# EAGLE design variablePedal (EAGLE 9.6.0)
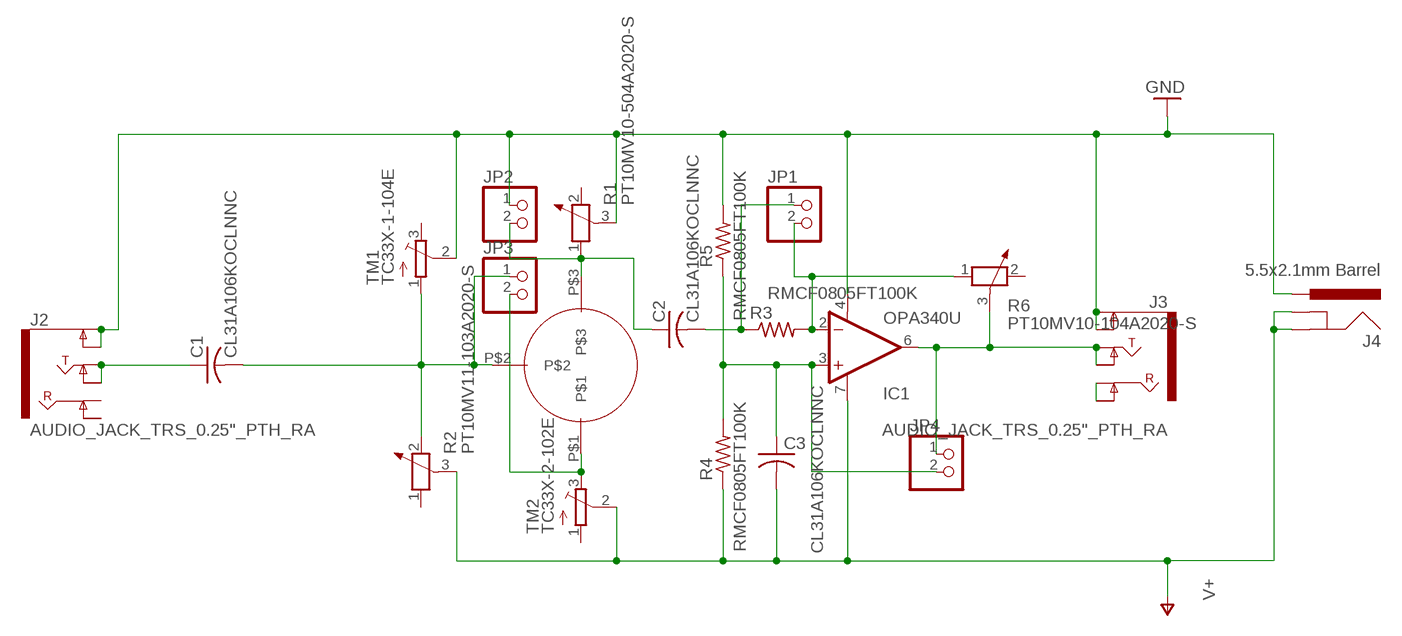
[diagram p0: schematic, sheet 1]

## Parts
C1  CL31A106KOCLNNC  C-USC1206  [C1206]
C2  CL31A106KOCLNNC  C-USC1206  [C1206]
C3  CL31A106KOCLNNC  C-USC1206  [C1206]
IC1  OPA340U  [SO08]
J2  AUDIO_JACK_TRS_0.25"_PTH_RA  [AUDIO_JACK_0.25"_TRS_PTH_RA]
J3  AUDIO_JACK_TRS_0.25"_PTH_RA  [AUDIO_JACK_0.25"_TRS_PTH_RA]
J4  5.5x2.1mm Barrel  POWER_JACKSMD  [POWER_JACK_SMD]
JP1  PINHD-1X2  [1X02]
JP2  PINHD-1X2  [1X02]
JP3  PINHD-1X2  [1X02]
JP4  PINHD-1X2  [1X02]
R1  PT10MV10-504A2020-S  POTENTIOMETER_PT-10  [PT-10]
R2  PT10MV11-103A2020-S  POTENTIOMETER_PT-10  [PT-10]
R3  RMCF0805FT100K  R-US_R0805  [R0805]
R4  RMCF0805FT100K  R-US_R0805  [R0805]
R5  RMCF0805FT100K  R-US_R0805  [R0805]
R6  PT10MV10-104A2020-S  POTENTIOMETER_PT-10  [PT-10]
TM1  TC33X-1-104E  TRIMPOTTC33X  [TC33X]
TM2  TC33X-2-102E  TRIMPOTTC33X  [TC33X]
U$1  917-43-103-41-005000  [TO-5]

## Nets
GND: IC1.4(V-) J2.SLEEVE(EARTH) J2.SLEEVE-NORM(EARTH-NORM) J3.SLEEVE(EARTH) J3.SLEEVE-NORM(EARTH-NORM) J4.VIN0(PWR) JP2.1 R1.3 R5.2 TM1.2(S)
N$1: C1.2 JP3.1 R2.2 TM1.1(A) U$1.P$2
N$2: C2.1 JP2.2 R1.1 U$1.P$3
N$3: JP3.2 TM2.3(E) U$1.P$1
N$4: C2.2 JP1.1 R3.1
N$5: C3.1 IC1.3(+IN) JP4.2 R4.2 R5.1
N$6: IC1.2(-IN) JP1.2 R3.2 R6.1
N$7: IC1.6(OUT) J3.TIP J3.TIP-NORM JP4.1 R6.3
N$8: J3.RING J3.RING-NORM
N$11: C1.1 J2.TIP J2.TIP-NORM
V+: C3.2 IC1.7(V+) J4.GND(GNDBREAK) J4.P$4(GND) R2.3 R4.1 TM2.2(S)
Unconnected: J2.RING J2.RING-NORM R1.2 R2.1 R6.2 TM1.3(E) TM2.1(A)

## Library data of the parts
C1-C3 = rcl:C-US: CAPACITOR, American symbol; SPICEPREFIX: C
IC1 = burr-brown:OPA340: Rail-to-Rail Operational Amplifiers Single-Supply, MicroAmplifier(TM) Series; MPN: OPA340UA; OC_FARNELL: 1106196; OC_NEWARK: 24M5449
J2 J3 = SparkFun-Connectors:AUDIO_JACK_TRS_0.25"_PTH_RA: Audio Jack, 1/4" TRS jack, horizontal, PTH, aka "Phono jack" Find the connector here: Audio Jack - 1/4" Stereo (right angle) <https://www.sparkfun.com/products/11144> (COM-11144) Datasheet <http://cdn.sparkfun.com/datasheets/Components/General/JP-611%20DD.jpg> Note, although the datasheet and physical part are slightly different, this footprint was proven to mate well on the Proto Pedal. This device is used on these SparkFun Products: SparkFun TRS Jack Breakout - 1/4" Stereo <https://www.sparkfun.com/products/13005> (BOB-13005 ) SparkFun Proto Pedal - sorry bad link - product comming soon! <https://www.sparkfun.com/products/13124> (PRT-13124); PROD_ID: CONN-12339; SF_ID: COM-11144
J4 = SparkFun-Connectors:POWER_JACK: Power Jack Connector This is the standard 5.5mm barrel jack for power. The PTH is the most common, proven, reliable, footprint. The Slot footprint only works if the mill layer is transmitted to the PCB fab house so be warned. Here are the connectors we sell at SparkFun: DC Barrel Power Jack/Connector <https://www.sparkfun.com/products/119> (PRT-00119) DC Barrel Power Jack/Connector (SMD) <https://www.sparkfun.com/products/12748> (PRT-12748) DC Barrel Jack Adapter - Breadboard Compatible <https://www.sparkfun.com/products/10811> (PRT-10811) It is used on this SparkFun product (and many, many others): SparkFun RedBoard - Programmed with Arduino <https://www.sparkfun.com/products/12757> (DEV-12757) Also, if you need a mating power supply or connector, please check these out: Wall Adapter Power Supply - 9VDC 650mA <https://www.sparkfun.com/products/298> (TOL-00298) DC Barrel Jack Adapter - Male <https://www.sparkfun.com/products/10287> (PRT-10287); PROD_ID: CONN-08106; SF_ID: PRT-12748
JP1-JP4 = pinhead:PINHD-1X2: PIN HEADER
R1 R2 R6 = rcl:POTENTIOMETER_: Potentiometer; SPICEMODEL: POT; SPICEPREFIX: X
R3-R5 = rcl:R-US_: RESISTOR, American symbol; SPICEPREFIX: R
TM1 TM2 = adafruit:TRIMPOT: SMT trimmer potentiometer part number TC33X http://www.ladyada.net/library/eagle
U$1 = FormE:917-43-103-41-005000

## Board
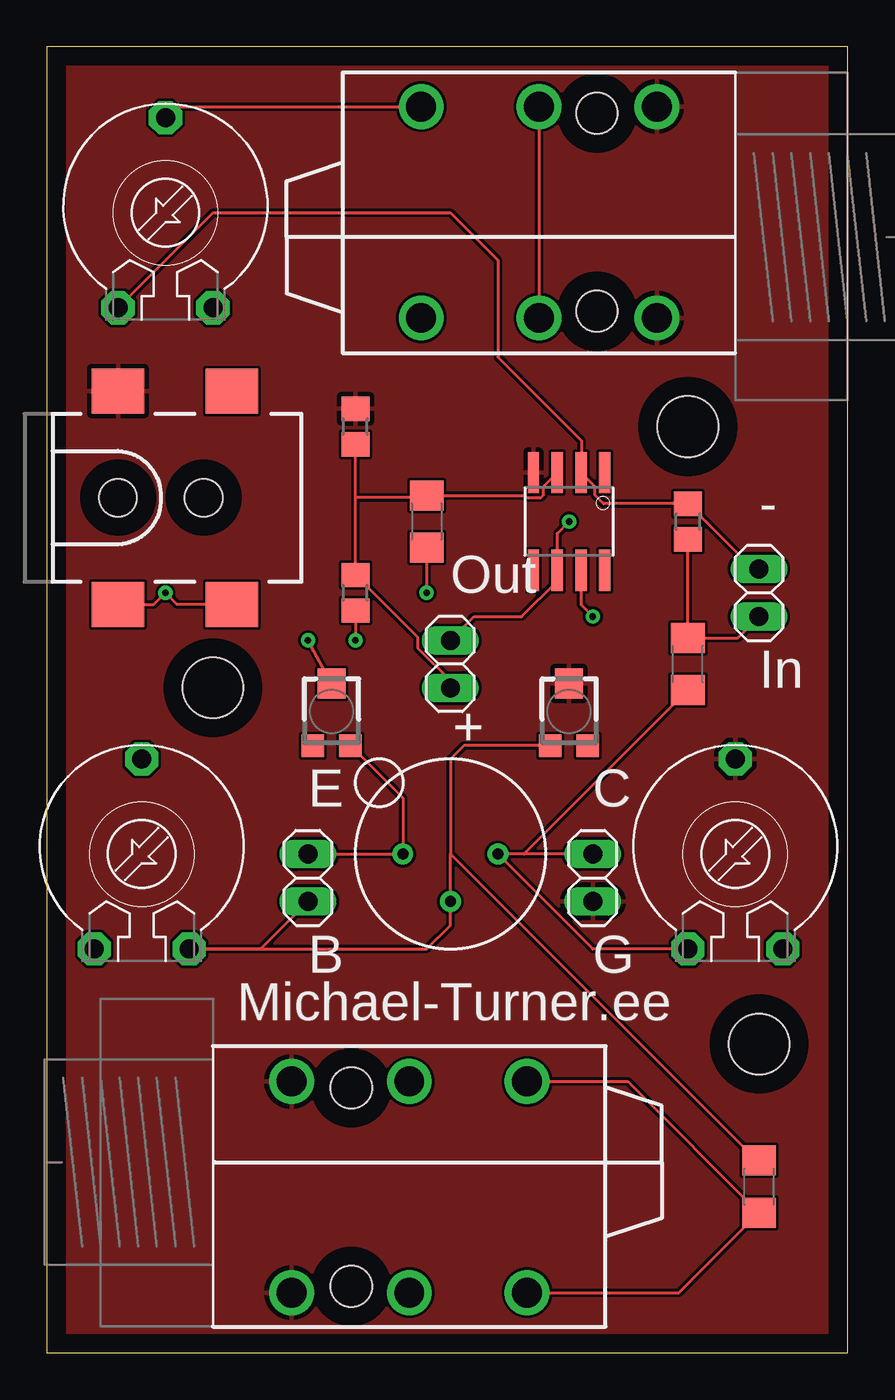
[diagram p1: board, top side]
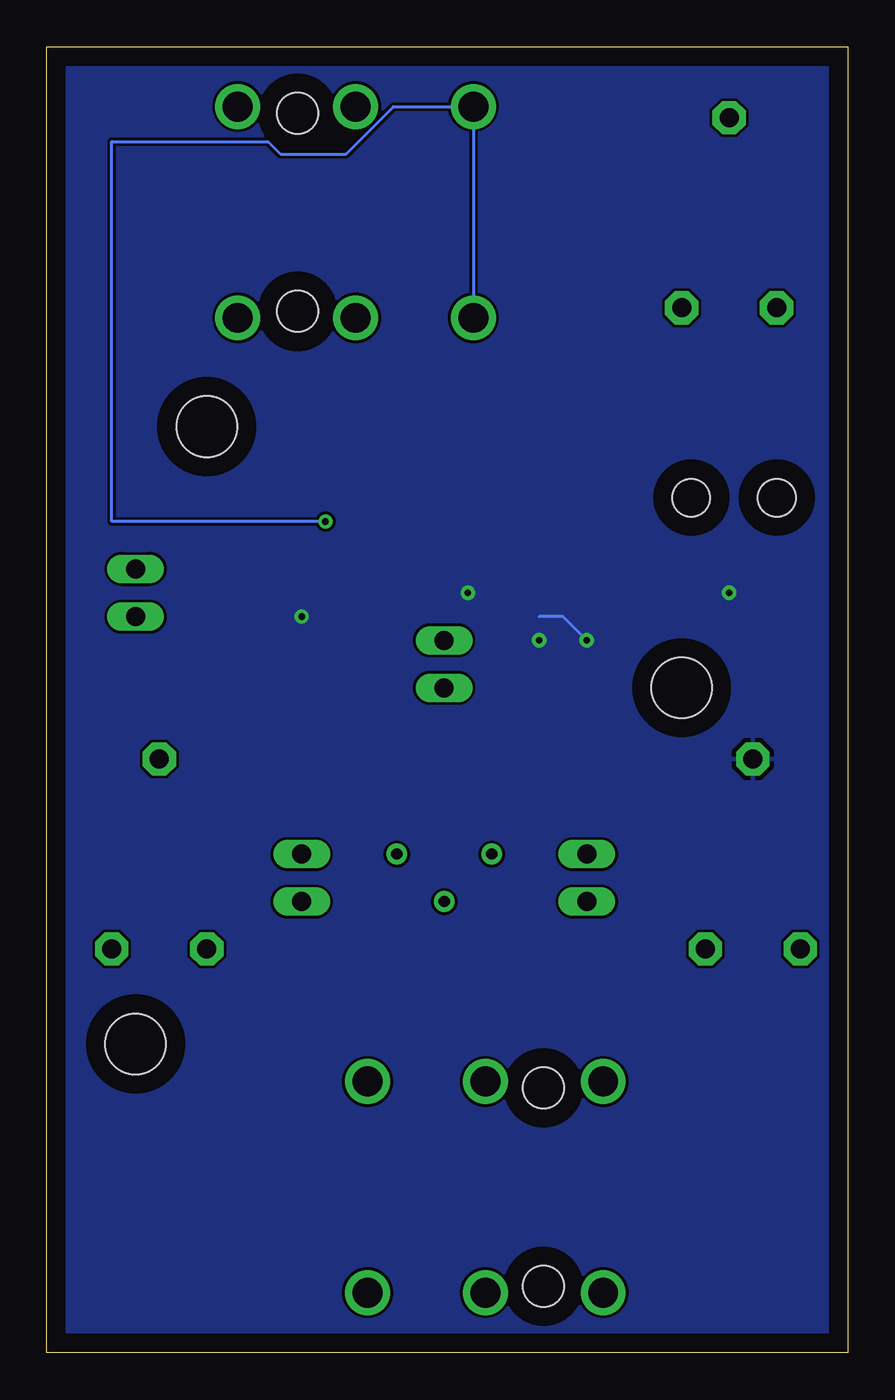
[diagram p2: board, bottom side, seen from below]

Size 42.85 x 69.84 mm. Coordinates in mm from the lower left corner, seen from the top.
Outline: 0,0 42.85,0 42.85,69.84 0,69.84 0,0
Copper layers (1*16): Top 0.035mm / dielectric 1.5mm / Bottom 0.035mm
Design rules "default": minimum track width 6mil, minimum drill 0.35mm, track to track 6mil, track to pad 6mil, pad to pad 6mil, via to via 6mil, smd to smd 6mil, copper to edge 40mil, drill to drill 6mil, minimum pad ring 10mil, minimum via ring 8mil, stop-mask expansion 4mil, vias tented up to drill 0mil, thermal gap 10mil
Holes 3.25 mm at 8.89,35.56 38.1,16.51 34.29,49.53

### Footprints (pad centres in the part's own frame; a part is rotated, then mirrored left to right if it is on the bottom)
C1206 = smd 1.6 x 1.8: 1 -1.4,0; 2 1.4,0
SO08 = smd 0.61 x 2.21: 1 -1.905,-2.616; 2 -0.635,-2.616; 3 0.635,-2.616; 4 1.905,-2.616; 5 1.905,2.616; 6 0.635,2.616; 7 -0.635,2.616; 8 -1.905,2.616
AUDIO_JACK_0.25"_TRS_PTH_RA = drill 1.6: RING 10.5,-6.95; RING-NORM 10.5,4.35; SLEEVE 4.2,-6.95; SLEEVE-NORM 4.2,4.35; TIP 16.8,-6.95; TIP-NORM 16.8,4.35 | hole 2.2: 7.4,4; 7.4,-6.6
POWER_JACK_SMD = smd 2.8 x 2.4: GND 0,-5.7; P$4 6.1,-5.7; VIN0 0,5.7; VIN1 6.1,5.7 | hole 2.032: 0,0; 4.572,0
1X02 = drill 1.016 long: 1 -1.27,0; 2 1.27,0
PT-10 = drill 1.016 pad 1.778 octagon: 1 -2.54,-5.08; 2 2.54,-5.08; 3 0,5.08
R0805 = smd 1.3 x 1.5: 1 -0.95,0; 2 0.95,0
TC33X = smd 1.2 x 1.2: 1 -1,-1.825; 3 1,-1.825 | smd 1.5 x 1.6: 2 0,1.5
TO-5 = drill 0.6: P$1 -2.54,0; P$2 0,-2.54; P$3 2.54,0

### Placement (x,y rotation side)
C1  38.1,8.89 90 top
C2  34.29,36.83 90 top
C3  20.32,44.45 270 top
IC1  27.94,44.45 180 top
J2  8.89,10.16 0 top
J3  36.83,59.69 180 top
J4  3.81,45.72 0 top
JP1  38.1,40.64 90 top
JP2  29.21,25.4 90 top
JP3  13.97,25.4 90 top
JP4  21.59,36.83 270 top
R1  36.83,26.67 0 top
R2  5.08,26.67 0 top
R3  34.29,44.45 90 top
R4  16.51,40.64 90 top
R5  16.51,49.53 90 top
R6  6.35,60.96 0 top
TM1  27.94,34.29 0 top
TM2  15.24,34.29 0 top
U$1  21.59,26.67 0 top

### Tracks (layer width: path | path; a pad name or v marks a point on that pad's centre or on a via)
GND
  pour Top: 0,0 0,69.85 43.18,69.85 43.18,0
N$1
  Top 0.152: 21.59,26.67 21.59,31.75 22.3,32.47 TM1.1 | 21.59,26.67 37.97,10.29 C1.2 | 21.59,26.67 U$1.P$2 21.59,22.86 20.32,21.59 R2.2 11.43,21.59 JP3.1
N$2
  Top 0.152: C2.1 25.53,26.67 U$1.P$3 | R1.1 29.21,21.59 U$1.P$3 | JP2.2 U$1.P$3
N$3
  Top 0.152: TM2.3 19.05,29.66 U$1.P$1 JP3.2
N$4
  Top 0.152: R3.1 C2.2 36.96,38.23 JP1.1
N$5
  Top 0.152: 16.51,45.72 R4.2 19.84,38.26 19.84,37.69 21.59,35.94 JP4.2 | 16.51,45.72 R5.1 | 16.51,45.72 20.19,45.72 C3.1 25.52,45.85 25.64,45.73 26.43,45.73 26.57,45.87 26.57,46.33 IC1.3
N$6
  Top 0.152: R6.1 8.89,60.96 21.59,60.96 24.13,58.42 24.13,53.24 28.6,48.77 28.6,47.09 IC1.2 29.31,46.33 29.31,45.87 29.78,45.4 R3.2 37.78,41.91 JP1.2
N$7  (via drill 0.35)
  Top 0.152: R6.3 6.95,66.64 J3.TIP | v27.94,44.45 27.3,43.82 27.3,41.91 IC1.6 27.3,41.28 25.4,39.37 22.86,39.37 JP4.1
  Bottom 0.152: v27.94,44.45 39.37,44.45 39.37,64.77 31.01,64.77 30.34,64.1 26.85,64.1 24.31,66.64 J3.TIP J3.TIP-NORM
N$8
  Top 0.152: J3.RING J3.RING-NORM
N$11
  Top 0.152: J2.TIP-NORM 31.08,14.51 C1.1 33.82,3.21 J2.TIP
V+  (via drill 0.35)
  Top 0.152: J4.GND 5.73,40.02 v6.35,40.64 6.97,40.02 J4.P$4 | TM2.2 v13.97,38.1 | R4.1 v16.51,38.1 | C3.2 v20.32,40.64 | IC1.7 28.57,40.01 v29.21,39.37
  Bottom 0.152: v13.97,38.1 15.24,39.37 16.51,39.37
  pour Bottom: 0,0 0,69.85 43.18,69.85 43.18,0

### Text on the board
tNames: - | Out | In | + | E | C | B | G | Michael-Turner.ee